# Altium project DCC Controller.PrjPCB
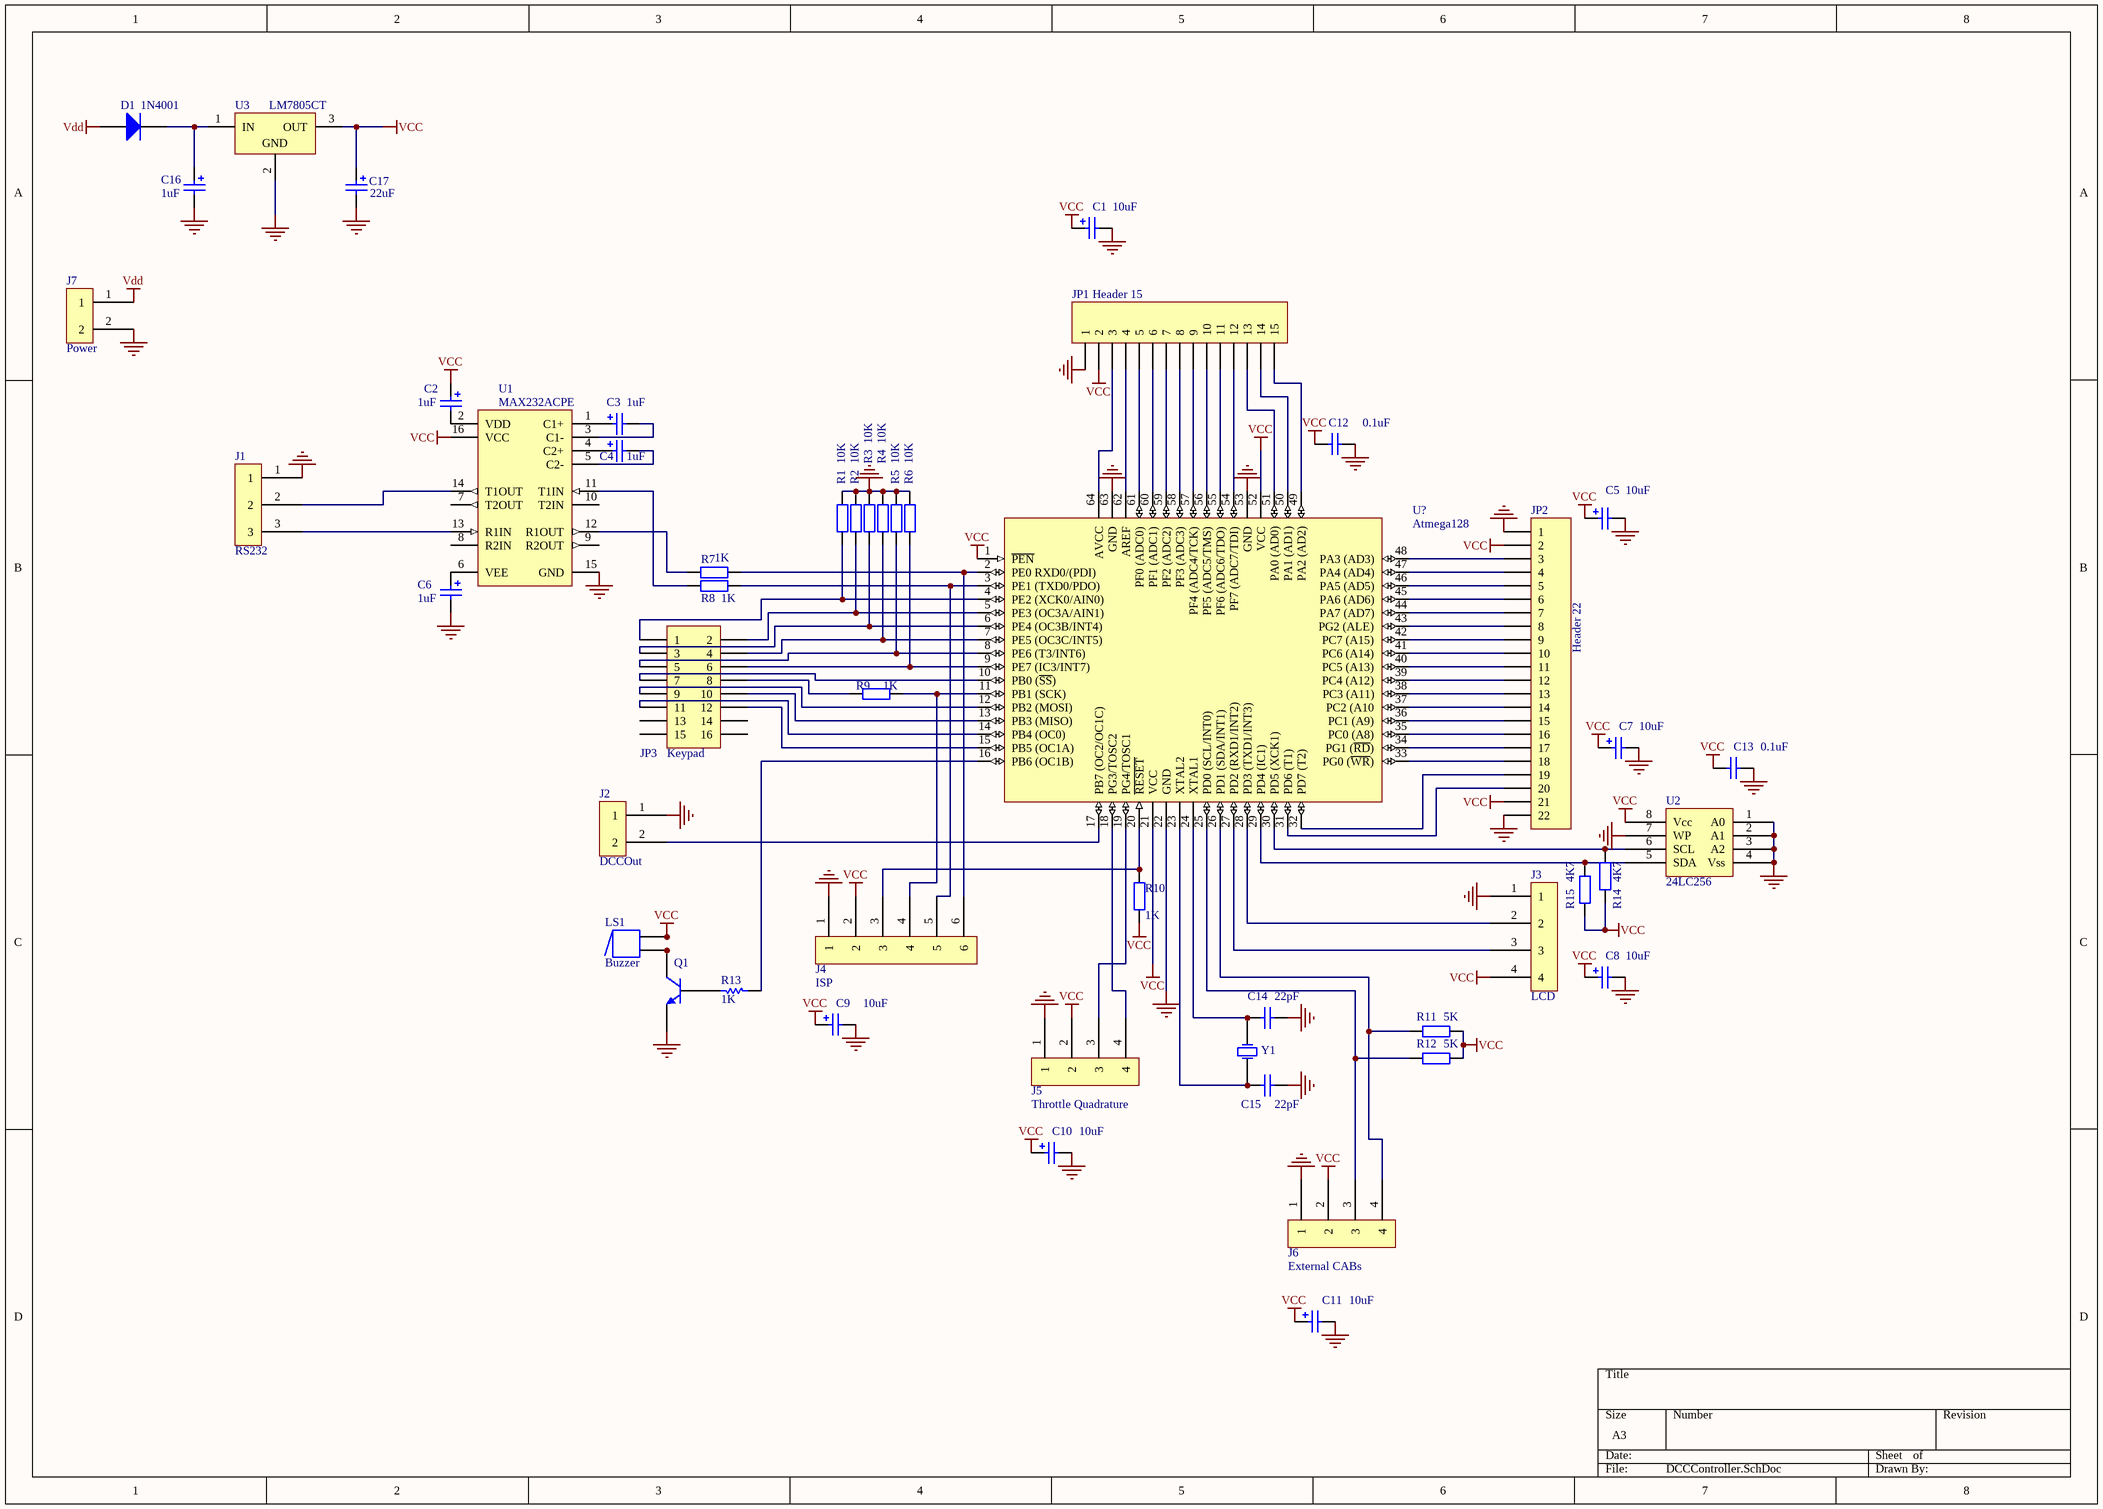
[diagram p0: DCCController.SchDoc]
1 sheet, 50 parts. Net scope: global (net labels, ports and power ports of the same name join across sheets).

## Sheet DCCController.SchDoc
size A3

### Parts
C1  value 10uF  [CC3216-1206]  (hidden comment: Cap Pol1)
C2  value 1uF  [CC3216-1206]  (hidden comment: Cap Pol1)
C3  value 1uF  [CC3216-1206]  (hidden comment: Cap Pol1)
C4  value 1uF  [CC3216-1206]  (hidden comment: Cap Pol1)
C5  value 10uF  [CC3216-1206]  (hidden comment: Cap Pol1)
C6  value 1uF  [CC3216-1206]  (hidden comment: Cap Pol1)
C7  value 10uF  [CC3216-1206]  (hidden comment: Cap Pol1)
C8  value 10uF  [CC3216-1206]  (hidden comment: Cap Pol1)
C9  value 10uF  [CC3216-1206]  (hidden comment: Cap Pol1)
C10  value 10uF  [CC3216-1206]  (hidden comment: Cap Pol1)
C11  value 10uF  [CC3216-1206]  (hidden comment: Cap Pol1)
C12  value 0.1uF  [RAD-0.1]  (hidden comment: Cap)
C13  value 0.1uF  [RAD-0.1]  (hidden comment: Cap)
C14  value 22pF  [CC2012-0805]  (hidden comment: Cap)
C15  value 22pF  [CC2012-0805]  (hidden comment: Cap)
C16  value 1uF  [CAPPR2-5X11]  (hidden comment: Cap Pol1)
C17  value 22uF  [CAPPR2.5-6.3X11.5]  (hidden comment: Cap Pol1)
D1  1N4001  [DIO10.46-5.3x2.8]
J1  RS232  [0.1 SIP 3 PIN]
J2  DCCOut  [0.1 SIP 2 PIN]
J3  LCD  [0.1 SIP 4 PIN]
J4  ISP  [0.1 SIP 6 PIN]
J5  Throttle Quadrature  [0.1 SIP 4 PIN]
J6  External CABs  [0.1 SIP 4 PIN]
J7  Power  [0.156 SIP 2 PIN]
JP1  Header 15  [HDR1X15]
JP2  Header 22  [HDR1X22]
JP3  Keypad  [HDR2X8]
LS1  Buzzer  [Mini PC Mount Piezo]
Q1  (no value)  [SO-G3]
R1  value 10K  [CR2012-0805]  (hidden comment: Res2)
R2  value 10K  [CR2012-0805]  (hidden comment: Res2)
R3  value 10K  [CR2012-0805]  (hidden comment: Res2)
R4  value 10K  [CR2012-0805]  (hidden comment: Res2)
R5  value 10K  [CR2012-0805]  (hidden comment: Res2)
R6  value 10K  [CR2012-0805]  (hidden comment: Res2)
R7  value 1K  [CR2012-0805]  (hidden comment: Res2)
R8  value 1K  [CR2012-0805]  (hidden comment: Res2)
R9  value 1K  [CR2012-0805]  (hidden comment: Res2)
R10  value 1K  [CR2012-0805]  (hidden comment: Res2)
R11  value 5K  [CR2012-0805]  (hidden comment: Res2)
R12  value 5K  [CR2012-0805]  (hidden comment: Res2)
R13  value 1K  [R2012-0805]  (hidden comment: Res1)
R14  value 4K7  [CR2012-0805]  (hidden comment: Res2)
R15  value 4K7  [CR2012-0805]  (hidden comment: Res2)
U1  MAX232ACPE  [PE16A]
U2  24LC256  [8P3]
U3  LM7805CT  [T03B]
U?  Atmega128  [64A]
Y1  XTAL  [Xtal Cylinder]  (value not drawn)

### Nets
GND: C1.2 C5.2 C6.2 C7.2 C8.2 C9.2 C10.2 C11.2 C12.2 C13.2 C14.2 C15.2 C16.2 C17.2 J1.1 J2.1 J3.1 J4.1 J5.1 J6.1 J7.2 JP1.1 JP2.1 JP2.22 Q1.2(E) R1.2 R2.2 R3.2 R4.2 R5.2 R6.2 U1.15(GND) U2.1(A0) U2.2(A1) U2.3(A2) U2.4(Vss) U2.7(WP) U3.2(GND) U?.22(GND) U?.53(GND) U?.63(GND)
VCC: C1.1 C2.1 C5.1 C7.1 C8.1 C9.1 C10.1 C11.1 C12.1 C13.1 C17.1 J3.4 J4.2 J5.2 J6.2 JP1.2 JP2.2 JP2.21 LS1.1 LS1.1A R10.1 R11.2 R12.2 R14.1 R15.1 U1.16(VCC) U2.8(Vcc) U3.3(OUT) U?.1(~{PEN}) U?.21(VCC) U?.52(VCC)
Vdd: D1.1(A) J7.1
NetC2_2: C2.2 U1.2(VDD)
NetC3_1: C3.1 U1.1(C1+)
NetC3_2: C3.2 U1.3(C1-)
NetC4_1: C4.1 U1.4(C2+)
NetC4_2: C4.2 U1.5(C2-)
NetC6_1: C6.1 U1.6(VEE)
NetC14_1: C14.1 U?.24(XTAL1) Y1.1(OSC1)
NetC15_1: C15.1 U?.23(XTAL2) Y1.2(OSC2)
NetC16_1: C16.1 D1.2(K) U3.1(IN)
NetJ1_2: J1.2 U1.14(T1OUT)
NetJ1_3: J1.3 U1.13(R1IN)
NetJ2_2: J2.2 U?.17(PB7_(OC2/OC1C))
NetJ3_2: J3.2 U?.28(PD3_(TXD1/INT3))
NetJ3_3: J3.3 U?.27(PD2_(RXD1/INT2))
NetJ4_3: J4.3 R10.2 U?.20(~{RESET})
NetJ4_4: J4.4 R9.2 U?.11(PB1_(SCK))
NetJ4_5: J4.5 R8.2 U?.3(PE1_(TXD0/PDO))
NetJ4_6: J4.6 R7.2 U?.2(PE0_RXD0/(PDI))
NetJ5_3: J5.3 U?.19(PG4/TOSC1)
NetJ5_4: J5.4 U?.18(PG3/TOSC2)
NetJ6_3: J6.3 R12.1 U?.25(PD0_(SCL/INT0))
NetJ6_4: J6.4 R11.1 U?.26(PD1_(SDA/INT1))
NetJP1_3: JP1.3 U?.64(AVCC)
NetJP1_4: JP1.4 U?.62(AREF)
NetJP1_5: JP1.5 U?.61(PF0_(ADC0))
NetJP1_6: JP1.6 U?.60(PF1_(ADC1))
NetJP1_7: JP1.7 U?.59(PF2_(ADC2))
NetJP1_8: JP1.8 U?.58(PF3_(ADC3))
NetJP1_9: JP1.9 U?.57(PF4_(ADC4/TCK))
NetJP1_10: JP1.10 U?.56(PF5_(ADC5/TMS))
NetJP1_11: JP1.11 U?.55(PF6_(ADC6/TDO))
NetJP1_12: JP1.12 U?.54(PF7_(ADC7/TDI))
NetJP1_13: JP1.13 U?.51(PA0_(AD0))
NetJP1_14: JP1.14 U?.50(PA1_(AD1))
NetJP1_15: JP1.15 U?.49(PA2_(AD2))
NetJP2_3: JP2.3 U?.48(PA3_(AD3))
NetJP2_4: JP2.4 U?.47(PA4_(AD4))
NetJP2_5: JP2.5 U?.46(PA5_(AD5))
NetJP2_6: JP2.6 U?.45(PA6_(AD6))
NetJP2_7: JP2.7 U?.44(PA7_(AD7))
NetJP2_8: JP2.8 U?.43(PG2_(ALE))
NetJP2_9: JP2.9 U?.42(PC7_(A15))
NetJP2_10: JP2.10 U?.41(PC6_(A14))
NetJP2_11: JP2.11 U?.40(PC5_(A13))
NetJP2_12: JP2.12 U?.39(PC4_(A12))
NetJP2_13: JP2.13 U?.38(PC3_(A11))
NetJP2_14: JP2.14 U?.37(PC2_(A10)
NetJP2_15: JP2.15 U?.36(PC1_(A9))
NetJP2_16: JP2.16 U?.35(PC0_(A8))
NetJP2_17: JP2.17 U?.34(PG1_(~{RD}))
NetJP2_18: JP2.18 U?.33(PG0_(~{WR}))
NetJP2_19: JP2.19 U?.32(PD7_(T2))
NetJP2_20: JP2.20 U?.31(PD6_(T1))
NetJP3_1: JP3.1 R1.1 U?.4(PE2_(XCK0/AIN0))
NetJP3_2: JP3.2 R2.1 U?.5(PE3_(OC3A/AIN1))
NetJP3_3: JP3.3 R3.1 U?.6(PE4_(OC3B/INT4))
NetJP3_4: JP3.4 R4.1 U?.7(PE5_(OC3C/INT5))
NetJP3_5: JP3.5 R5.1 U?.8(PE6_(T3/INT6))
NetJP3_6: JP3.6 R6.1 U?.9(PE7_(IC3/INT7))
NetJP3_7: JP3.7 U?.10(PB0_(~{SS}))
NetJP3_8: JP3.8 R9.1
NetJP3_9: JP3.9 U?.12(PB2_(MOSI))
NetJP3_10: JP3.10 U?.13(PB3_(MISO))
NetJP3_11: JP3.11 U?.14(PB4_(OC0))
NetJP3_12: JP3.12 U?.15(PB5_(OC1A))
NetLS1_2: LS1.2 LS1.2A Q1.3(C)
NetQ1_1: Q1.1(B) R13.2
NetR7_1: R7.1 U1.12(R1OUT)
NetR8_1: R8.1 U1.11(T1IN)
NetR13_1: R13.1 U?.16(PB6_(OC1B))
NetR14_2: R14.2 U2.6(SCL) U?.30(PD5_(XCK1))
NetR15_2: R15.2 U2.5(SDA) U?.29(PD4_(IC1))

Not connected (* = marked no-connect by the designer): JP3 13 14 15 16; U1 7(T2OUT) 8(R2IN) 9(R2OUT) 10(T2IN)

### Library data of the parts
C1-C11 C16 C17 = Cap Pol1: Polarized Capacitor (Radial); Published: 8-Jun-2000; Revision: July-2002: Re-released for DXP Platform.; Publisher: Altium Limited
C12-C15 = Cap: Capacitor; Published: 8-Jun-2000; Revision: July-2002: Re-released for DXP Platform.; Publisher: Altium Limited
D1 = Diode 1N4001: 1 Amp General Purpose Rectifier; Revision 1: 11-Jul-2000: SIM Model Added.; Revision 2: 17-Jul-2002: Re-released for DXP Platform.; Package Information: Latest Revision: Aug-1999; Code - JEDEC: DO-204-AL; Published: 8-Jun-2000; Datasheet: Latest Revision: 1998; Package Reference: DO-41; Publisher: Altium Limited
J1 = SIP3 CONNECTOR
J2 J7 = SIP2 CONNECTOR
J3 J5 J6 = SIP4 CONNECTOR
J4 = SIP6 CONNECTOR
JP1 = Header 15: Header, 15-Pin; Revision: 17-Jul-2002: Re-released for DXP Platform.; Publisher: Altium Limited
JP2 = Header 22: Header, 22-Pin; Revision: 17-Jul-2002: Re-released for DXP Platform.; Publisher: Altium Limited
JP3 = Header 8X2: Header, 8-Pin, Dual row; Revision: 17-Jul-2002: Re-released for DXP Platform.; Publisher: Altium Limited
LS1 = Buzzer: Magnetic Transducer Buzzer; Revision 1: Jul-2002: Re-released for DXP Platform.; Revision 2: 17-Dec-2003: Schematic revised, PCB Footprint replaced.; Published: 17-Dec-2003; Datasheet: Latest Revision: 17-Dec-2003; Publisher: Altium Limited
Q1 = MMBT100A: General Purpose Amplifier NPN Silicon; Package Information: Latest Revision: 1997; Published: 29-Sep-2000; Datasheet: Latest Revision: 1996; Package Reference: 318-08; Publisher: Altium Limited; Revision: 17-Jul-2002: Re-released for DXP Platform.
R1-R12 R14 R15 = Res2: Resistor; Published: 8-Jun-2000; Revision: July-2002: Re-released for DXP Platform.; Publisher: Altium Limited
R13 = Res1: Resistor; Published: 8-Jun-2000; Revision: July-2002: Re-released for DXP Platform.; Publisher: Altium Limited
U1 = MAX232ACPE: +5V Powered, Multi-Channel RS-232 Driver/Receiver; Package Information: Latest Revision: 1997; Code - JEDEC: MS-001-BB; Published: 16-Jan-2001; Revision: 17-Jul-2002: Re-released for DXP Platform.; Package Reference: PE16A; Publisher: Altium Limited
U3 = LM7805CT: Series 3-Terminal Positive Regulator; Package Information: Latest Revision: 1995; Note: Tab is connected to GND; Published: 15-Apr-2002; Datasheet: Latest Revision: May-1999; Package Reference: T03B; Publisher: Altium Limited
Y1 = XTAL: Crystal Oscillator; Published: 8-Jun-2000; Revision: July-2002: Re-released for DXP Platform.; Publisher: Altium Limited